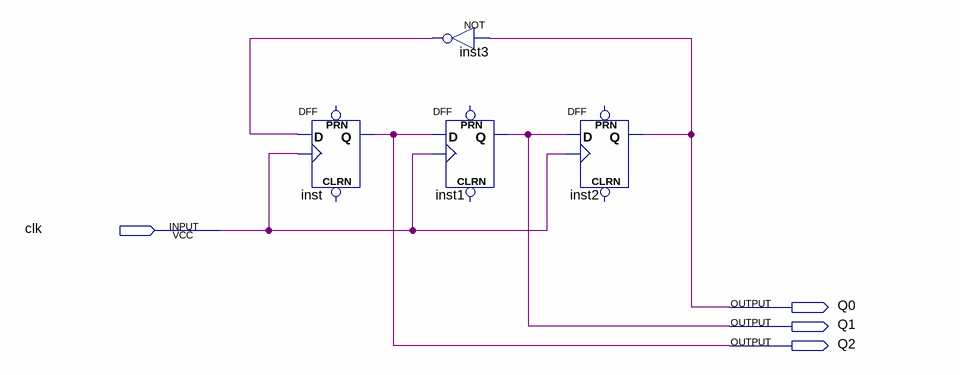
[diagram p0: schematic sheet]
// Quartus schematic hong_t1.bdf as structural Verilog: 4 symbols, 4 pins
module hong_t1 (
  input  clk,
  output Q0,
  output Q1,
  output Q2
);

  wire inst3_out;

  DFF inst (.CLK(clk), .D(inst3_out), .Q(Q2));  // open: CLRN, PRN
  not inst3 (inst3_out, Q0);
  DFF inst1 (.CLK(clk), .D(Q2), .Q(Q1));  // open: CLRN, PRN
  DFF inst2 (.CLK(clk), .D(Q1), .Q(Q0));  // open: CLRN, PRN
endmodule
